# EAGLE design oven-controller-v3 (EAGLE 6.4)
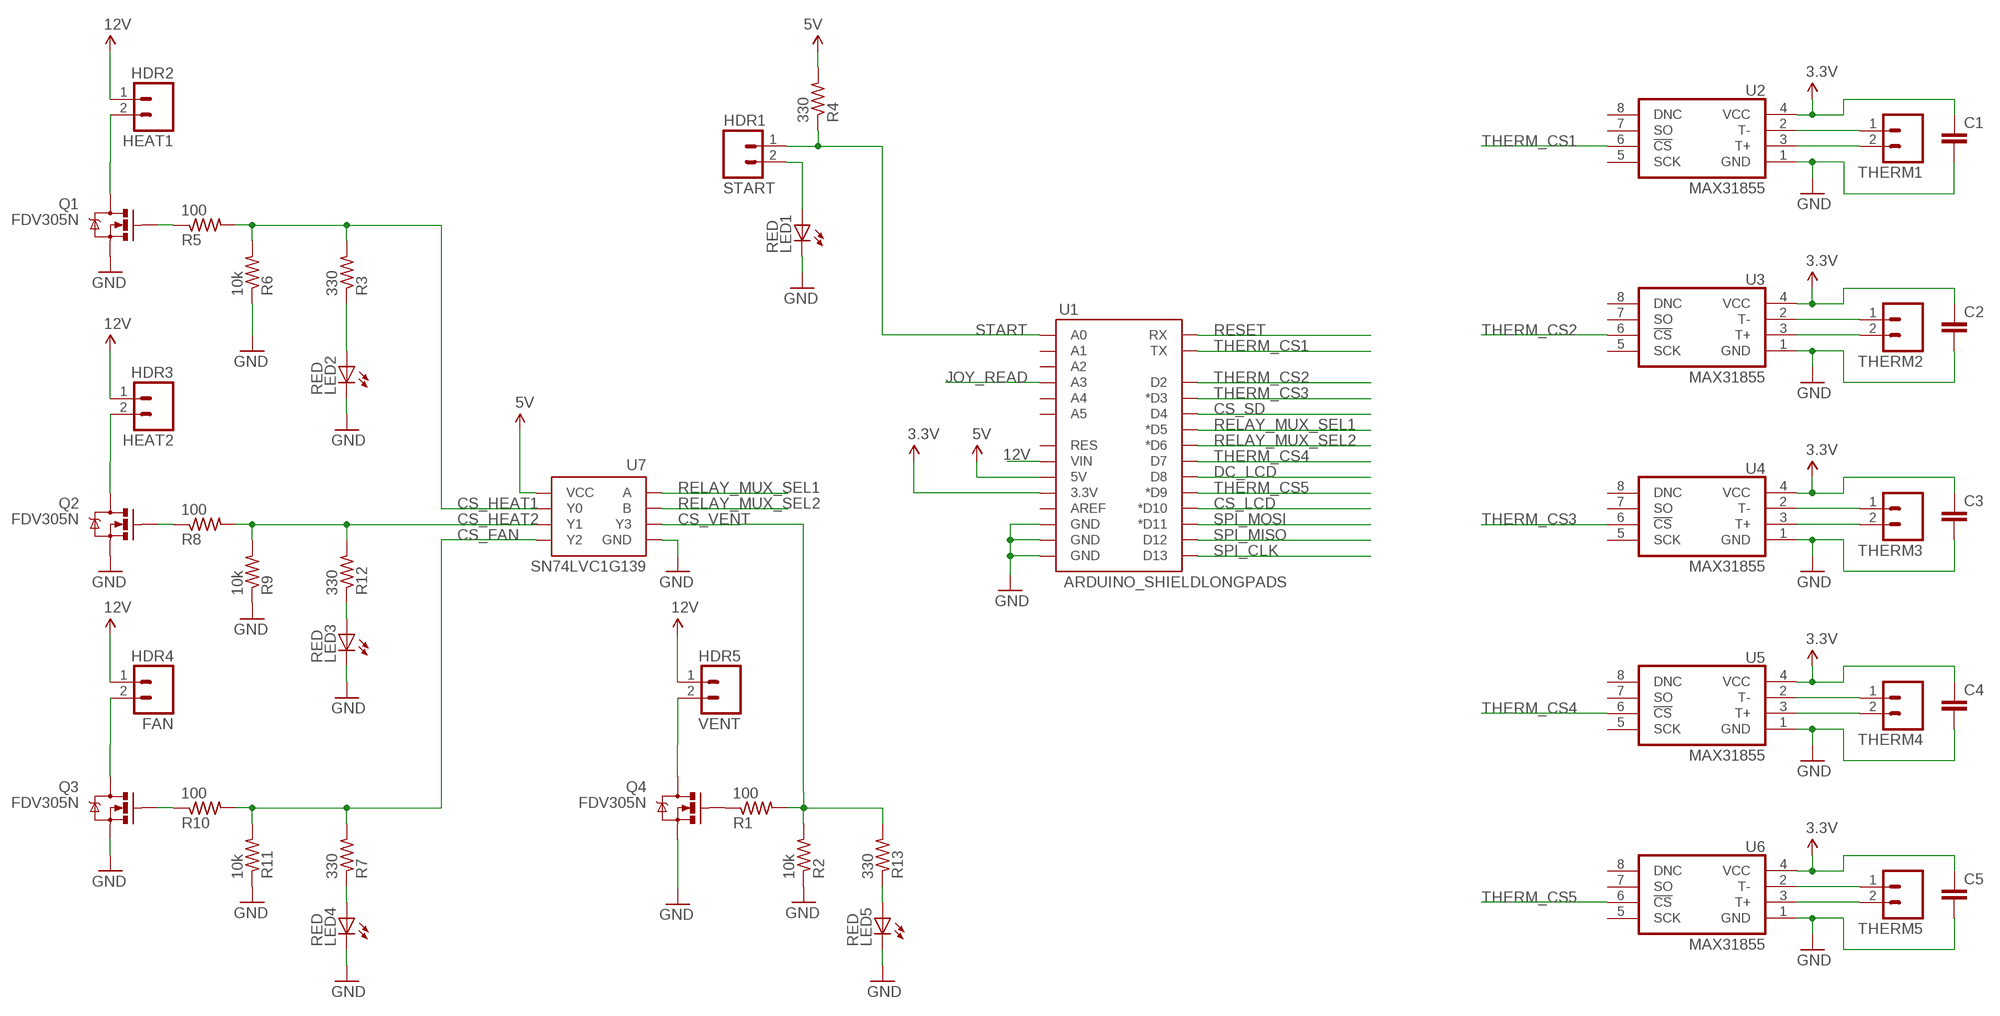
[diagram p0: schematic, sheet 1]

## Parts
C1  C-EUC0603K  [C0603K]
C2  C-EUC0603K  [C0603K]
C3  C-EUC0603K  [C0603K]
C4  C-EUC0603K  [C0603K]
C5  C-EUC0603K  [C0603K]
FAN  HDR4  M023.5MM_LOCK  [SCREWTERMINAL-3.5MM-2_LOCK]
HEAT1  HDR2  M023.5MM_LOCK  [SCREWTERMINAL-3.5MM-2_LOCK]
HEAT2  HDR3  M023.5MM_LOCK  [SCREWTERMINAL-3.5MM-2_LOCK]
LED1  RED  LED0603  [LED-0603]
LED2  RED  LED0603  [LED-0603]
LED3  RED  LED0603  [LED-0603]
LED4  RED  LED0603  [LED-0603]
LED5  RED  LED0603  [LED-0603]
Q1  FDV305N  MOSFET-NCHANNELSMD  [SOT23-3]
Q2  FDV305N  MOSFET-NCHANNELSMD  [SOT23-3]
Q3  FDV305N  MOSFET-NCHANNELSMD  [SOT23-3]
Q4  FDV305N  MOSFET-NCHANNELSMD  [SOT23-3]
R1  100  R-US_0603-C-NOSILK  [0603-C-NOSILK]
R2  10k  R-US_0603-C-NOSILK  [0603-C-NOSILK]
R3  330  R-US_0603-C-NOSILK  [0603-C-NOSILK]
R4  330  R-US_0603-C-NOSILK  [0603-C-NOSILK]
R5  100  R-US_0603-C-NOSILK  [0603-C-NOSILK]
R6  10k  R-US_0603-C-NOSILK  [0603-C-NOSILK]
R7  330  R-US_0603-C-NOSILK  [0603-C-NOSILK]
R8  100  R-US_0603-C-NOSILK  [0603-C-NOSILK]
R9  10k  R-US_0603-C-NOSILK  [0603-C-NOSILK]
R10  100  R-US_0603-C-NOSILK  [0603-C-NOSILK]
R11  10k  R-US_0603-C-NOSILK  [0603-C-NOSILK]
R12  330  R-US_0603-C-NOSILK  [0603-C-NOSILK]
R13  330  R-US_0603-C-NOSILK  [0603-C-NOSILK]
START  HDR1  M023.5MM_LOCK  [SCREWTERMINAL-3.5MM-2_LOCK]
THERM1  M023.5MM_LOCK  [SCREWTERMINAL-3.5MM-2_LOCK]
THERM2  M023.5MM_LOCK  [SCREWTERMINAL-3.5MM-2_LOCK]
THERM3  M023.5MM_LOCK  [SCREWTERMINAL-3.5MM-2_LOCK]
THERM4  M023.5MM_LOCK  [SCREWTERMINAL-3.5MM-2_LOCK]
THERM5  M023.5MM_LOCK  [SCREWTERMINAL-3.5MM-2_LOCK]
U1  ARDUINO_SHIELDLONGPADS  [DUEMILANOVE_SHIELD_LONGPADS]
U2  MAX31855  IC_MAX31855-SO-8  [SO-8]
U3  MAX31855  IC_MAX31855-SO-8  [SO-8]
U4  MAX31855  IC_MAX31855-SO-8  [SO-8]
U5  MAX31855  IC_MAX31855-SO-8  [SO-8]
U6  MAX31855  IC_MAX31855-SO-8  [SO-8]
U7  SN74LVC1G139  [8LSSOP]
VENT  HDR5  M023.5MM_LOCK  [SCREWTERMINAL-3.5MM-2_LOCK]

## Nets
3.3V: C1.1 C2.1 C3.1 C4.1 C5.1 U1.3.3V U2.4(VCC) U3.4(VCC) U4.4(VCC) U5.4(VCC) U6.4(VCC)
5V: R4.2 U1.5V U7.P$8(VCC)
12V: FAN.1 HEAT1.1 HEAT2.1 U1.VIN VENT.1
CS_FAN: R7.2 R10.2 R11.2 U7.P$5(Y2)
CS_HEAT1: R3.2 R5.2 R6.2 U7.P$7(Y0)
CS_HEAT2: R8.2 R9.2 R12.2 U7.P$6(Y1)
CS_LCD: U1.D10(*D10)
CS_SD: U1.D4
CS_VENT: R1.2 R2.2 R13.2 U7.P$3(Y3)
DC_LCD: U1.D8
GND: C1.2 C2.2 C3.2 C4.2 C5.2 LED1.C LED2.C LED3.C LED4.C LED5.C Q1.2(S) Q2.2(S) Q3.2(S) Q4.2(S) R2.1 R6.1 R9.1 R11.1 U1.GND@0(GND) U1.GND@1(GND) U1.GND@2(GND) U2.1(GND) U3.1(GND) U4.1(GND) U5.1(GND) U6.1(GND) U7.P$4(GND)
HDR3: FAN.2 Q3.3(D)
JOY_READ: U1.A3
N$1: Q1.1(G) R5.1
N$2: Q4.1(G) R1.1
N$3: Q4.3(D) VENT.2
N$4: HEAT1.2 Q1.3(D)
N$5: THERM1.1 U2.2(T-)
N$6: THERM1.2 U2.3(T+)
N$7: LED2.A R3.1
N$8: THERM2.1 U3.2(T-)
N$9: LED4.A R7.1
N$10: LED1.A START.2
N$11: THERM2.2 U3.3(T+)
N$12: THERM3.1 U4.2(T-)
N$13: THERM3.2 U4.3(T+)
N$14: THERM4.1 U5.2(T-)
N$15: THERM4.2 U5.3(T+)
N$16: THERM5.1 U6.2(T-)
N$17: THERM5.2 U6.3(T+)
N$18: LED3.A R12.1
N$19: LED5.A R13.1
N$20: Q2.1(G) R8.1
N$21: HEAT2.2 Q2.3(D)
N$23: Q3.1(G) R10.1
RELAY_MUX_SEL1: U1.D5(*D5) U7.P$1(A)
RELAY_MUX_SEL2: U1.D6(*D6) U7.P$2(B)
RESET: U1.RX
SPI_CLK: U1.D13
SPI_MISO: U1.D12
SPI_MOSI: U1.D11(*D11)
START: R4.1 START.1 U1.A0
THERM_CS1: U1.TX U2.6(!CS)
THERM_CS2: U1.D2 U3.6(!CS)
THERM_CS3: U1.D3(*D3) U4.6(!CS)
THERM_CS4: U1.D7 U5.6(!CS)
THERM_CS5: U1.D9(*D9) U6.6(!CS)
Unconnected: U1.A1 U1.A2 U1.A4 U1.A5 U1.AREF U1.RES U2.5(SCK) U2.7(SO) U2.8(DNC) U3.5(SCK) U3.7(SO) U3.8(DNC) U4.5(SCK) U4.7(SO) U4.8(DNC) U5.5(SCK) U5.7(SO) U5.8(DNC) U6.5(SCK) U6.7(SO) U6.8(DNC)

## Library data of the parts
C1-C5 = rcl_custom:C-EU: CAPACITOR, European symbol
FAN HEAT1 HEAT2 START THERM1-THERM5 VENT = SparkFun-Connectors:M02: Header 2 Standard 2-pin 0.1" header. Use with straight break away headers (SKU : PRT-00116), right angle break away headers (PRT-00553), swiss pins (PRT-00743), machine pins (PRT-00117), and female headers (PRT-00115). Molex polarized connector foot print use with SKU : PRT-08233 with associated crimp pins and housings.
LED1-LED5 = SparkFun-LED:LED: LEDs Standard schematic elements and footprints for 5mm, 3mm, 1206, and 0603 sized LEDs. 5mm - Spark Fun Electronics SKU : COM-00529 (and others)
Q1-Q4 = SparkFun-DiscreteSemi:MOSFET-NCHANNEL: Generic NMOS footprint
R1-R13 = rcl_custom:R-US_: RESISTOR, American symbol
U1 = SparkFun-Boards:ARDUINO_SHIELD: Arduino shield footprint
U2-U6 = dp_devices:IC_MAX31855
U7 = wicker:SN74LVC1G139

## Board
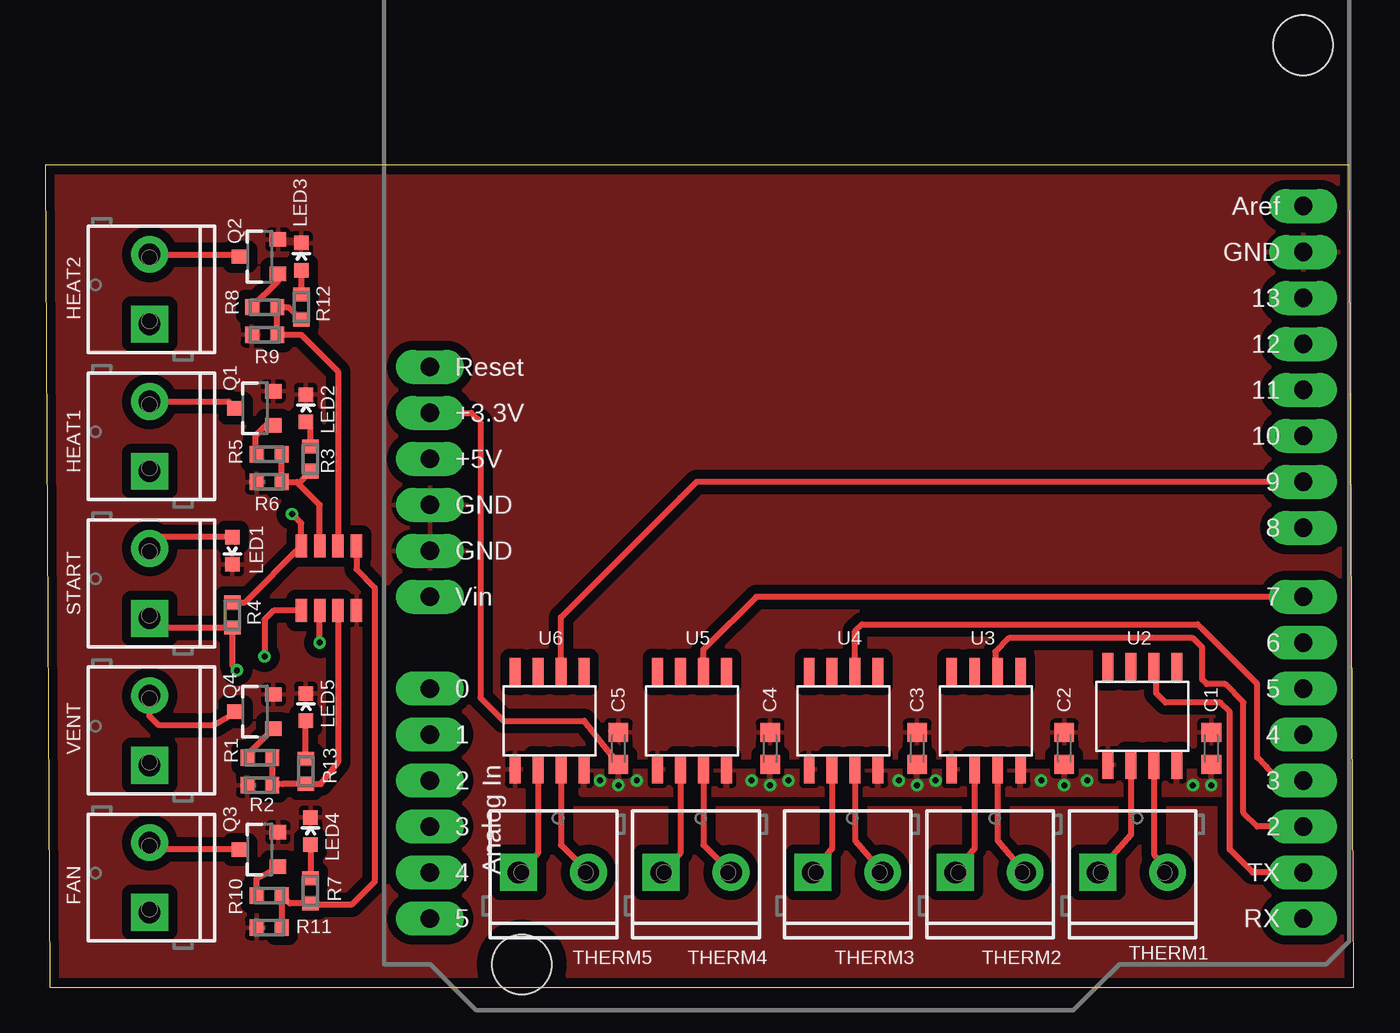
[diagram p1: board, top side]
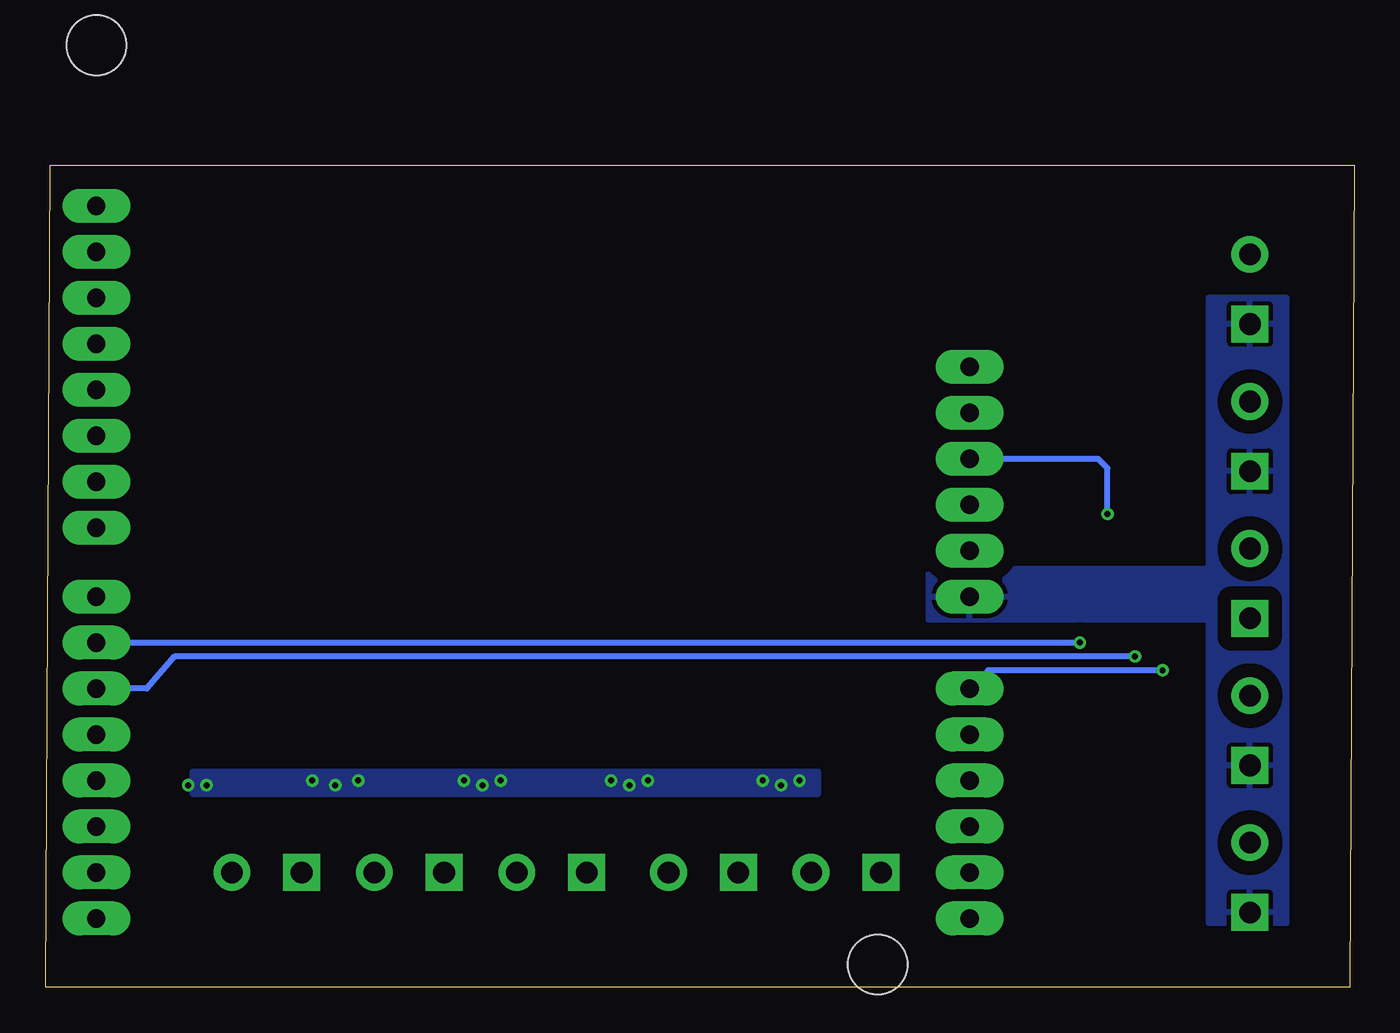
[diagram p2: board, bottom side, seen from below]

Size 72.31 x 45.45 mm. Coordinates in mm from the lower left corner, seen from the top.
Outline: 72.31,0 72.06,45.45 0,45.45 0.25,0 72.31,0
Copper layers (1*16): Top 0.0356mm / dielectric 1.5011mm / Bottom 0.0356mm
Design rules "LaenPCBOrder": minimum track width 6mil, minimum drill 13mil, track to track 6mil, track to pad 6mil, pad to pad 6mil, via to via 6mil, smd to smd 6mil, copper to edge 15mil, drill to drill 6mil, minimum pad ring 7mil, minimum via ring 7mil, stop-mask expansion 3mil, vias tented up to drill 0mil, thermal gap 10mil

### Footprints (pad centres in the part's own frame; a part is rotated, then mirrored left to right if it is on the bottom)
C0603K = smd 1.05 x 1.08: 1 -0.875,0; 2 0.875,0
SCREWTERMINAL-3.5MM-2_LOCK = drill 1.2 pad 2.032 square: 1 -0.178,0 | drill 1.2 pad 2.032: 2 3.678,0
LED-0603 = smd 0.8 x 0.8: A 0,-0.75; C 0,0.75
SOT23-3 = smd 0.8 x 0.9: 1 -0.95,-1; 2 0.95,-1; 3 0,1.1
0603-C-NOSILK = smd 0.75 x 0.9: 1 -0.7,0; 2 0.7,0
DUEMILANOVE_SHIELD_LONGPADS = drill 1.016 pad 1.88 long: 3.3V 50.8,26.67; 5V 50.8,29.21; A0 50.8,41.91; A1 50.8,44.45; A2 50.8,46.99; A3 50.8,49.53; A4 50.8,52.07; A5 50.8,54.61; AREF 2.54,15.24; D2 2.54,49.53; D3 2.54,46.99; D4 2.54,44.45; D5 2.54,41.91; D6 2.54,39.37; D7 2.54,36.83; D8 2.54,33.02; D9 2.54,30.48; D10 2.54,27.94; D11 2.54,25.4; D12 2.54,22.86; D13 2.54,20.32; GND@0 50.8,31.75; GND@1 50.8,34.29; GND@2 2.54,17.78; RES 50.8,24.13; RX 2.54,54.61; TX 2.54,52.07; VIN 50.8,36.83 | hole 3.302: 45.72,57.15; 2.54,6.35
SO-8 = smd 0.6 x 1.55: 1 -1.905,-2.69; 2 -0.635,-2.69; 3 0.635,-2.69; 4 1.905,-2.69; 5 1.905,2.71; 6 0.635,2.71; 7 -0.635,2.71; 8 -1.905,2.71
8LSSOP = smd 1.27 x 0.635: P$1 -1.778,2.794; P$2 -1.778,1.778; P$3 -1.778,0.762; P$4 -1.778,-0.254; P$5 1.778,-0.254; P$6 1.778,0.762; P$7 1.778,1.778; P$8 1.778,2.794

### Placement (x,y rotation side)
C1  64.44,13.21 90 top
C2  56.31,13.21 90 top
C3  48.18,13.21 90 top
C4  40.06,13.21 90 top
C5  31.67,13.21 90 top
FAN  5.77,4.32 90 top
HEAT1  5.77,28.7 90 top
HEAT2  5.77,36.83 90 top
LED1  10.34,24.13 180 top
LED2  14.4,32 0 top
LED3  14.15,40.39 0 top
LED4  14.66,8.64 0 top
LED5  14.4,15.49 0 top
Q1  11.61,32 90 top
Q2  11.86,40.39 90 top
Q3  11.86,7.62 90 top
Q4  11.61,15.24 90 top
R1  11.86,12.7 0 top
R2  11.86,11.18 0 top
R3  14.66,29.21 270 top
R4  10.34,20.57 90 top
R5  12.37,29.46 0 top
R6  12.37,27.94 0 top
R7  14.66,5.33 270 top
R8  12.12,37.59 0 top
R9  12.12,36.07 0 top
R10  12.37,5.08 0 top
R11  12.37,3.3 0 top
R12  14.15,37.59 270 top
R13  14.4,11.94 270 top
START  5.77,20.57 90 top
THERM1  58.34,6.35 0 top
THERM2  50.47,6.35 0 top
THERM3  42.6,6.35 0 top
THERM4  34.21,6.35 0 top
THERM5  26.34,6.35 0 top
U1  72.06,58.42 180 top
U2  60.63,14.99 0 top
U3  51.99,14.73 0 top
U4  44.12,14.73 0 top
U5  35.74,14.73 0 top
U6  27.86,14.73 0 top
U7  16.94,22.61 90 top
VENT  5.77,12.45 90 top

### Tracks (layer width: path | path; a pad name or v marks a point on that pad's centre or on a via)
3.3V  (via drill 0.33)
  Top 0.33: U1.3.3V 23.55,31.75 24.05,31.24 24.05,16 25.32,14.73 29.78,14.73 C5.1
  other vias: 30.66,11.43 32.69,11.43 39.04,11.43 41.07,11.43 47.17,11.43 49.2,11.43 55.04,11.43 57.58,11.43 64.44,11.18 63.42,11.18 31.67,11.18 40.06,11.18 48.18,11.18 56.31,11.18
  pour Top (isolate 0.254, rank 2): 64.95,10.67 29.64,10.67 29.64,11.94 64.95,11.94
  pour Bottom: 29.64,11.94 29.64,10.67 64.19,10.67 64.19,11.94
5V  (via drill 0.33 pad 0.69)
  Top 0.33: R4.2 11.04,21.27 U7.P$8 14.15,25.65 v13.64,26.16
  Bottom 0.33: v13.64,26.16 13.64,28.7 14.15,29.21 U1.5V
12V
  pour Bottom (isolate 0.762): 3.73,38.1 8.05,38.1 8.05,23.11 23.55,23.11 23.55,20.32 8.05,20.32 8.05,3.56 3.73,3.56
CS_FAN
  Top 0.33: U7.P$5 17.2,23.11 18.21,22.1 18.21,7.37 18.21,5.84 16.94,4.57 14.72,4.57 R7.2 13.52,4.63 R10.2 R11.2
CS_HEAT1
  Top 0.33: R5.2 R6.2 13.89,27.94 | 13.89,27.94 14.09,27.94 R3.2 | U7.P$7 15.16,26.67 13.89,27.94
CS_HEAT2
  Top 0.33: R12.2 13.45,37.59 R8.2 R9.2 14.15,36.07 16.18,34.04 U7.P$6
CS_VENT
  Top 0.33: R1.2 R2.2 13.13,11.24 R13.2 15.23,11.24 16.18,12.45 U7.P$3
GND
  pour Top (isolate 0.508, rank 6): -0.58,-1.27 72.57,-1.27 72.57,46.99 -0.58,46.99
HDR3
  Top 0.33: Q3.3 6.15,7.62 FAN.2
N$1
  Top 0.33: Q1.1 12.18,31.05 11.61,30.48 11.61,29.53 R5.1
N$2
  Top 0.33: R1.1 11.16,12.84 Q4.1
N$3
  Top 0.33: Q4.3 10.51,15.16 9.32,14.48 6.27,14.48 5.77,14.99 VENT.2
N$4
  Top 0.33: HEAT1.2 10.13,32.38 Q1.3
N$5
  Top 0.33: U2.2 59.99,8.43 THERM1.1
N$6
  Top 0.33: U2.3 61.27,7.36 THERM1.2
N$7
  Top 0.33: R3.1 14.66,31 LED2.A
N$8
  Top 0.33: U3.2 51.36,7.67 THERM2.1
N$9
  Top 0.33: LED4.A R7.1
N$10
  Top 0.33: LED1.A 6.39,24.88 START.2
N$11
  Top 0.33: U3.3 52.63,8.12 THERM2.2
N$12
  Top 0.33: U4.2 43.48,7.67 THERM3.1
N$13
  Top 0.33: U4.3 44.76,8.12 THERM3.2
N$14
  Top 0.33: U5.2 35.1,7.42 THERM4.1
N$15
  Top 0.33: U5.3 36.37,7.87 THERM4.2
N$16
  Top 0.33: U6.2 27.23,7.42 THERM5.1
N$17
  Top 0.33: U6.3 28.5,7.87 THERM5.2
N$18
  Top 0.33: LED3.A R12.1
N$19
  Top 0.33: R13.1 LED5.A
N$20
  Top 0.33: Q2.1 12.86,39.04 R8.1
N$21
  Top 0.33: HEAT2.2 10.64,40.51 Q2.3
N$23
  Top 0.33: R10.1 11.67,5.99 Q3.1
RELAY_MUX_SEL1  (via drill 0.33 pad 0.69)
  Top 0.33: U7.P$1 12.62,20.83 12.12,20.32 v12.12,18.29
  Bottom 0.33: v12.12,18.29 65.2,18.29 66.73,16.51 U1.D5
RELAY_MUX_SEL2  (via drill 0.33 pad 0.69)
  Top 0.33: v15.16,19.05 U7.P$2
  Bottom 0.33: U1.D6 v15.16,19.05
START  (via drill 0.33 pad 0.69)
  Top 0.33: START.1 6.29,19.87 R4.1 10.34,17.78 v10.59,17.53
  Bottom 0.33: v10.59,17.53 20.24,17.53 U1.A0
THERM_CS1
  Top 0.33: U1.TX 66.73,6.35 65.46,7.62 65.46,15.24 64.95,15.75 61.9,15.75 61.39,16.26 61.39,17.57 U2.6
THERM_CS2
  Top 0.33: U1.D2 66.98,8.89 66.22,9.65 66.22,15.75 65.2,16.76 64.19,16.76 63.93,17.02 63.93,18.8 63.42,19.3 53.26,19.3 52.5,18.54 52.5,17.57 U3.6
THERM_CS3
  Top 0.33: U1.D3 68.25,11.43 67.49,12.19 66.98,12.7 66.98,16.76 64.06,19.68 | 64.06,19.68 63.93,19.81 | U4.6 44.76,19.68 45.14,20.07 63.68,20.07 64.06,19.68
THERM_CS4
  Top 0.33: U1.D7 39.29,21.59 36.5,18.8 36.37,18.67 U5.6
THERM_CS5
  Top 0.33: U6.6 28.5,20.45 35.1,27.05 | 35.1,27.05 35.48,27.43 | U1.D9 35.99,27.94 35.1,27.05